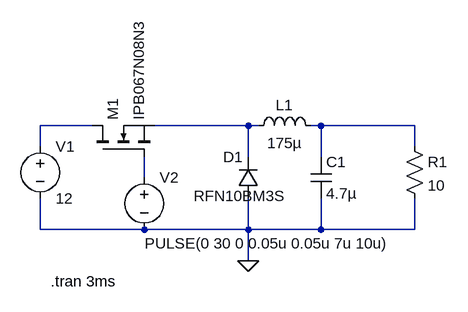
[diagram p0: schematic buck_converter_realistic.asc]
buck_converter_realistic.asc, the LTspice schematic file:
Version 4.1
SHEET 1 880 680
WIRE 128 80 48 80
WIRE 368 80 224 80
WIRE 384 80 368 80
WIRE 480 80 464 80
WIRE 624 80 480 80
WIRE 48 112 48 80
WIRE 624 112 624 80
WIRE 368 128 368 80
WIRE 480 128 480 80
WIRE 208 160 208 128
WIRE 48 240 48 192
WIRE 208 240 48 240
WIRE 368 240 368 192
WIRE 368 240 208 240
WIRE 480 240 480 192
WIRE 480 240 368 240
WIRE 624 240 624 192
WIRE 624 240 480 240
WIRE 368 288 368 240
FLAG 368 288 0
SYMBOL voltage 48 96 R0
WINDOW 123 0 0 Left 0
WINDOW 39 0 0 Left 0
SYMATTR InstName V1
SYMATTR Value 12
SYMBOL nmos 128 128 R270
SYMATTR InstName M1
SYMATTR Value IPB067N08N3
SYMBOL voltage 208 144 R0
WINDOW 3 1 117 Left 2
WINDOW 123 0 0 Left 0
WINDOW 39 0 0 Left 0
SYMATTR InstName V2
SYMATTR Value PULSE(0 30 0 0.05u 0.05u 7u 10u)
SYMBOL diode 384 192 R180
WINDOW 0 24 64 Left 2
WINDOW 3 -42 4 Left 2
SYMATTR InstName D1
SYMATTR Value RFN10BM3S
SYMBOL cap 464 128 R0
SYMATTR InstName C1
SYMATTR Value 4.7µ
SYMBOL res 608 96 R0
SYMATTR InstName R1
SYMATTR Value 10
SYMBOL ind 368 96 R270
WINDOW 0 32 56 VTop 2
WINDOW 3 5 56 VBottom 2
SYMATTR InstName L1
SYMATTR Value 175µ
TEXT 64 320 Left 2 !.tran 3ms

The netlist it stands for:
* buck_converter_realistic.asc
V1 N001 0 12
M1 N001 N004 N002 N002 IPB067N08N3
V2 N004 0 PULSE(0 30 0 0.05u 0.05u 7u 10u)
D1 0 N002 RFN10BM3S
C1 N003 0 4.7µ
R1 N003 0 10
L1 N002 N003 175µ
.model D D
.lib standard.dio
.model NMOS NMOS
.model PMOS PMOS
.lib standard.mos
.tran 3ms
.backanno
.end